# EAGLE design attinybreakout (EAGLE 5.06)
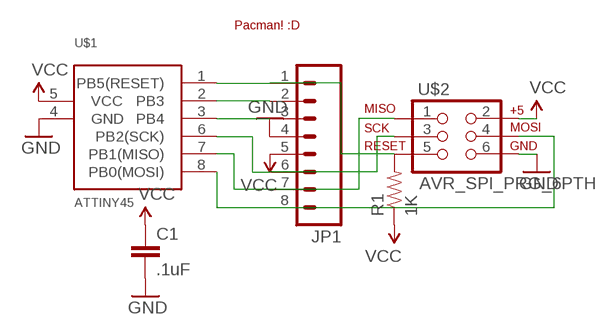
[diagram p0: schematic, sheet 1]

## Parts
C1  .1uF  CAP0603-CAP  [0603-CAP]
JP1  M08LOCK  [1X08_LOCK]
R1  1K  RESISTOR0603-RES  [0603-RES]
U$1  ATTINY45  [SOIC-8]
U$2  AVR_SPI_PRG_6PTH  [2X3]
U$3  PAC  [PAC]

## Nets
GND: C1.2 JP1.4 U$1.4(GND) U$2.6
N$1: JP1.1 R1.2 U$1.1(PB5(RESET)) U$2.5
N$3: JP1.2 U$1.2(PB3)
N$4: JP1.3 U$1.3(PB4)
N$5: JP1.7 U$1.7(PB1(MISO)) U$2.1
N$6: JP1.8 U$1.8(PB0(MOSI)) U$2.4
N$7: JP1.6 U$1.6(PB2(SCK)) U$2.3
VCC: C1.1 JP1.5 R1.1 U$1.5(VCC) U$2.2

## Library data of the parts
C1 = joshashby:CAP: Standard 0603 ceramic capacitor
JP1 = SparkFun:M08: Header 8 Standard 8-pin 0.1" header. Use with straight break away headers (SKU : PRT-00116), right angle break away headers (PRT-00553), swiss pins (PRT-00743), machine pins (PRT-00117), and female headers (PRT-00115).
R1 = SparkFun:RESISTOR: Resistor Basic schematic elements and footprints for 0603, 1206, and PTH 1/10th watt (small) resistors.
U$1 = joshashby:ATTINY45: Attiny45
U$2 = SparkFun:AVR_SPI_PRG_6: AVR ISP 6 Pin This is the reduced ISP connector for AVR programming. Common on Arduino. This footprint will take up less PCB space and can be used with a 10-pin to 6-pin adapter such as SKU: BOB-08508
U$3 = joshashby:PAC: Pacman! :D

## Board
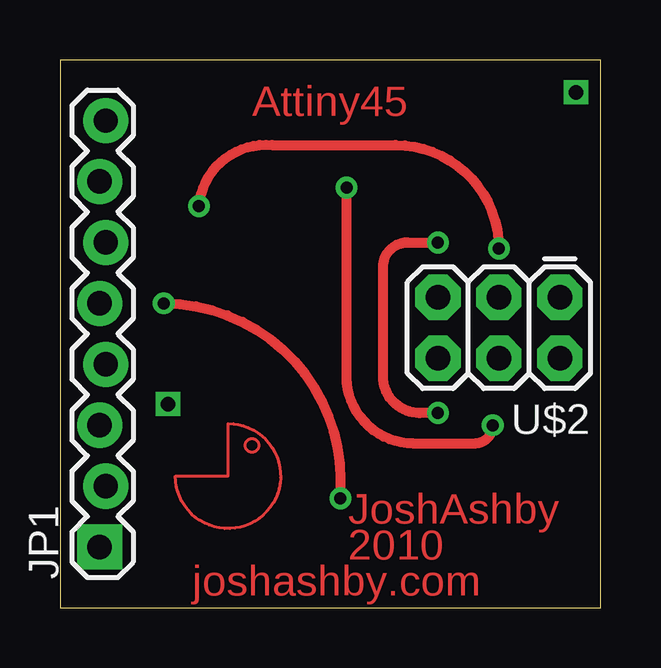
[diagram p1: board, top side]
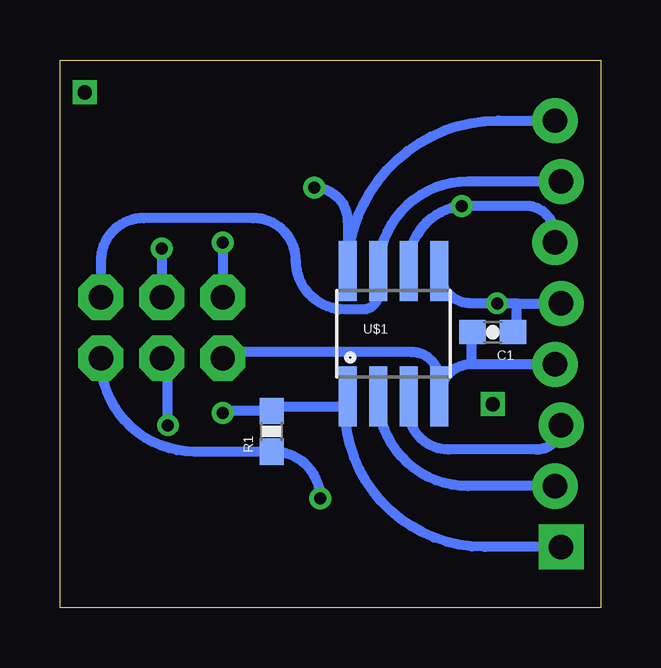
[diagram p2: board, bottom side, seen from below]

Size 22.53 x 22.85 mm. Coordinates in mm from the lower left corner, seen from the top.
Outline: 0,0 22.53,0 22.53,22.85 0,22.85 0,0
Copper layers (1*16): Top 0.035mm / dielectric 1.5mm / Bottom 0.035mm
Design rules "default *": minimum track width 1mil, minimum drill 1mil, track to track 5mil, track to pad 5mil, pad to pad 5mil, via to via 5mil, smd to smd 5mil, copper to edge 20mil, drill to drill 10mil, minimum pad ring 10mil, minimum via ring 8mil, stop-mask expansion 4mil, vias tented up to drill 0mil, thermal gap 10mil

### Footprints (pad centres in the part's own frame; a part is rotated, then mirrored left to right if it is on the bottom)
0603-CAP = smd 1.1 x 1: 1 -0.85,0; 2 0.85,0
1X08_LOCK = drill 1.016 pad 1.88 square: 1 0,0.127 | drill 1.016 pad 1.88 round: 2 2.54,-0.127; 3 5.08,0.127; 4 7.62,-0.127; 5 10.16,0.127; 6 12.7,-0.127; 7 15.24,0.127; 8 17.78,-0.127
0603-RES = smd 1.1 x 1: 1 -0.85,0; 2 0.85,0
SOIC-8 = smd 0.75 x 2.5: 1 -1.905,-2.616; 2 -0.635,-2.616; 3 0.635,-2.616; 4 1.905,-2.616; 5 1.905,2.616; 6 0.635,2.616; 7 -0.635,2.616; 8 -1.905,2.616
2X3 = drill 1.016 pad 1.88 octagon: 1 0,0; 2 0,2.54; 3 2.54,0; 4 2.54,2.54; 5 5.08,0; 6 5.08,2.54

### Placement (x,y rotation side)
C1  4.5,11.5 180 bottom
JP1  1.78,2.54 90 top
R1  13.72,7.37 90 bottom
U$1  8.64,11.43 0 bottom
U$2  20.83,12.95 180 top
U$3  7,5.5 0 top

### Tracks (layer width: path | path; a pad name or v marks a point on that pad's centre or on a via)
GND
  Bottom 0.406: 5.38,10.16 arc-90 U$1.4 6.73,9.53 arc-90 7.87,10.67 15.49,10.67 arc-90 U$2.6 | JP1.4 5.38,10.16 | C1.2 5.38,11.5 5.38,10.16
N$1  (via drill 0.5)
  Top 0.406: v15.75,8.13 14.99,8.13 arc-90 13.46,9.65 13.46,14.22 arc-90 14.48,15.24 v15.75,15.24
  Bottom 0.406: JP1.1 4.83,2.54 arc90 10.67,8.38 | 10.67,8.38 10.67,8.69 arc90 U$1.1 | v15.75,8.13 arc90 15.66,8.22 R1.2 arc90 13.55,8.38 10.67,8.38 | v15.75,15.24 U$2.5
N$2  (via drill 0.6)
  other vias: 21.5,21.5
N$3
  Bottom 0.406: JP1.2 5.54,5.08 arc90 U$1.2
N$4
  Bottom 0.406: JP1.3 arc90 2.67,6.6 6.35,6.6 arc90 8,8.26 U$1.3
N$5
  Bottom 0.406: JP1.7 5.54,17.78 arc-90 U$1.7 9.27,13.08 arc90 9.91,12.45 10.67,12.45 arc90 12.7,14.48 arc-90 14.48,16.26 19.05,16.26 arc-90 20.83,14.48 U$2.1
N$6  (via drill 0.5)
  Top 0.406: v11.94,17.53 11.94,9.65 arc90 14.73,6.86 17.27,6.86 arc90 v18.03,7.62
  Bottom 0.406: JP1.8 4.27,20.32 arc-90 U$1.8 10.54,16.13 arc-90 v11.94,17.53 | v18.03,7.62 18.03,10.16 arc-90 U$2.4
N$7  (via drill 0.5)
  Top 0.406: v18.29,14.99 arc90 13.97,19.3 8.84,19.3 arc90 v5.79,16.76
  Bottom 0.406: JP1.6 arc-90 2.92,16.76 v5.79,16.76 arc-90 U$1.6 | v18.29,14.99 U$2.3
N$8  (via drill 0.6)
  other vias: 4.5,8.5
VCC  (via drill 0.5)
  Top 0.406: v11.68,4.57 11.68,5.33 arc90 v4.32,12.7
  Bottom 0.406: U$1.5 arc-90 5.38,12.7 v4.32,12.7 3.5,12.7 | U$2.2 arc-90 16.93,6.52 R1.1 13.63,6.52 arc90 v11.68,4.57 | 3.5,12.7 JP1.5 | C1.1 3.5,11.5 3.5,12.7

### Text on the board
Top: Attiny45 | JoshAshby | 2010 | joshashby.com